# EAGLE schematic RH007.1 (EAGLE 7.1.0)
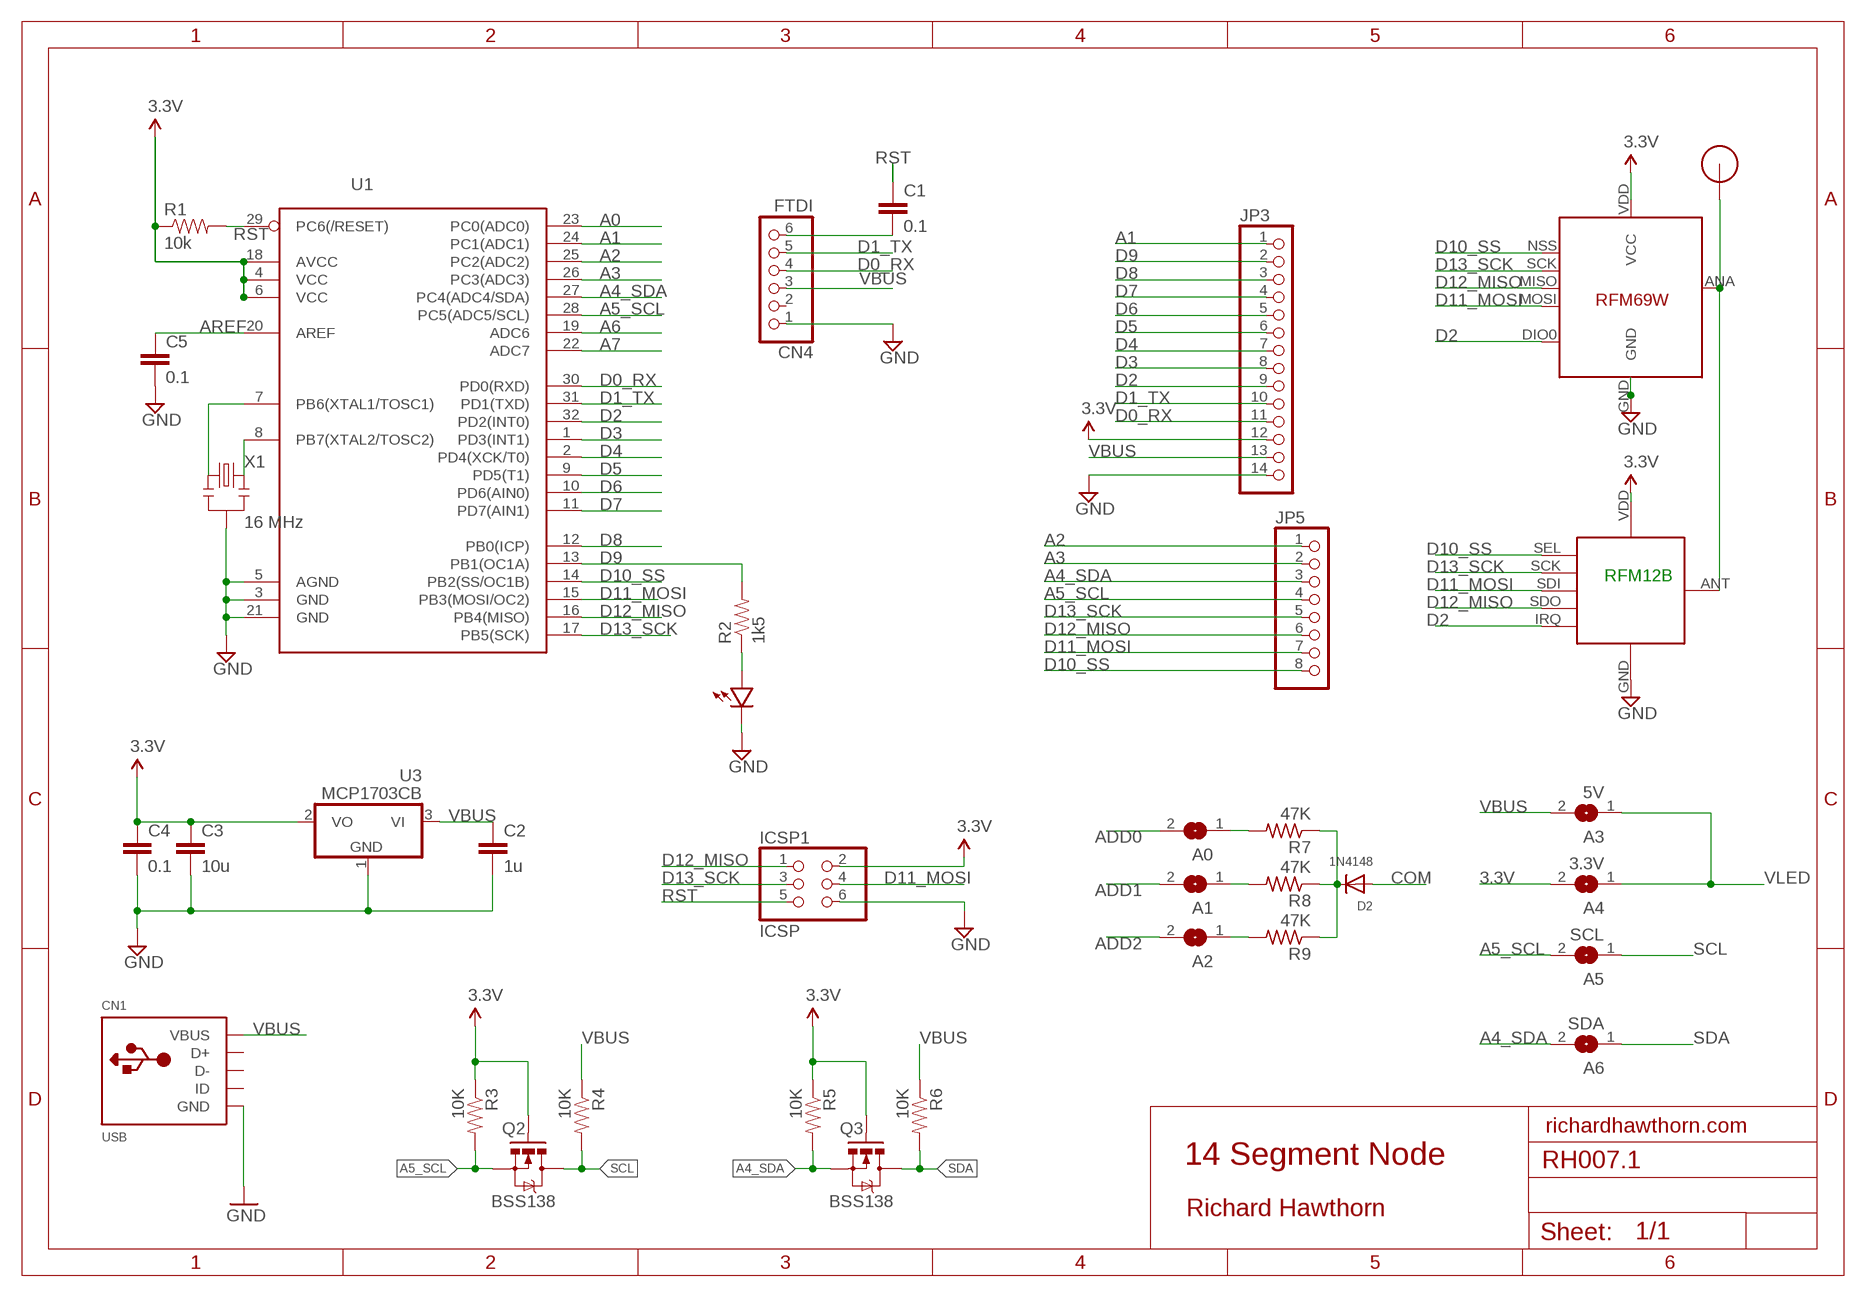
[diagram p0: schematic, sheet 1, part 1 of 2]
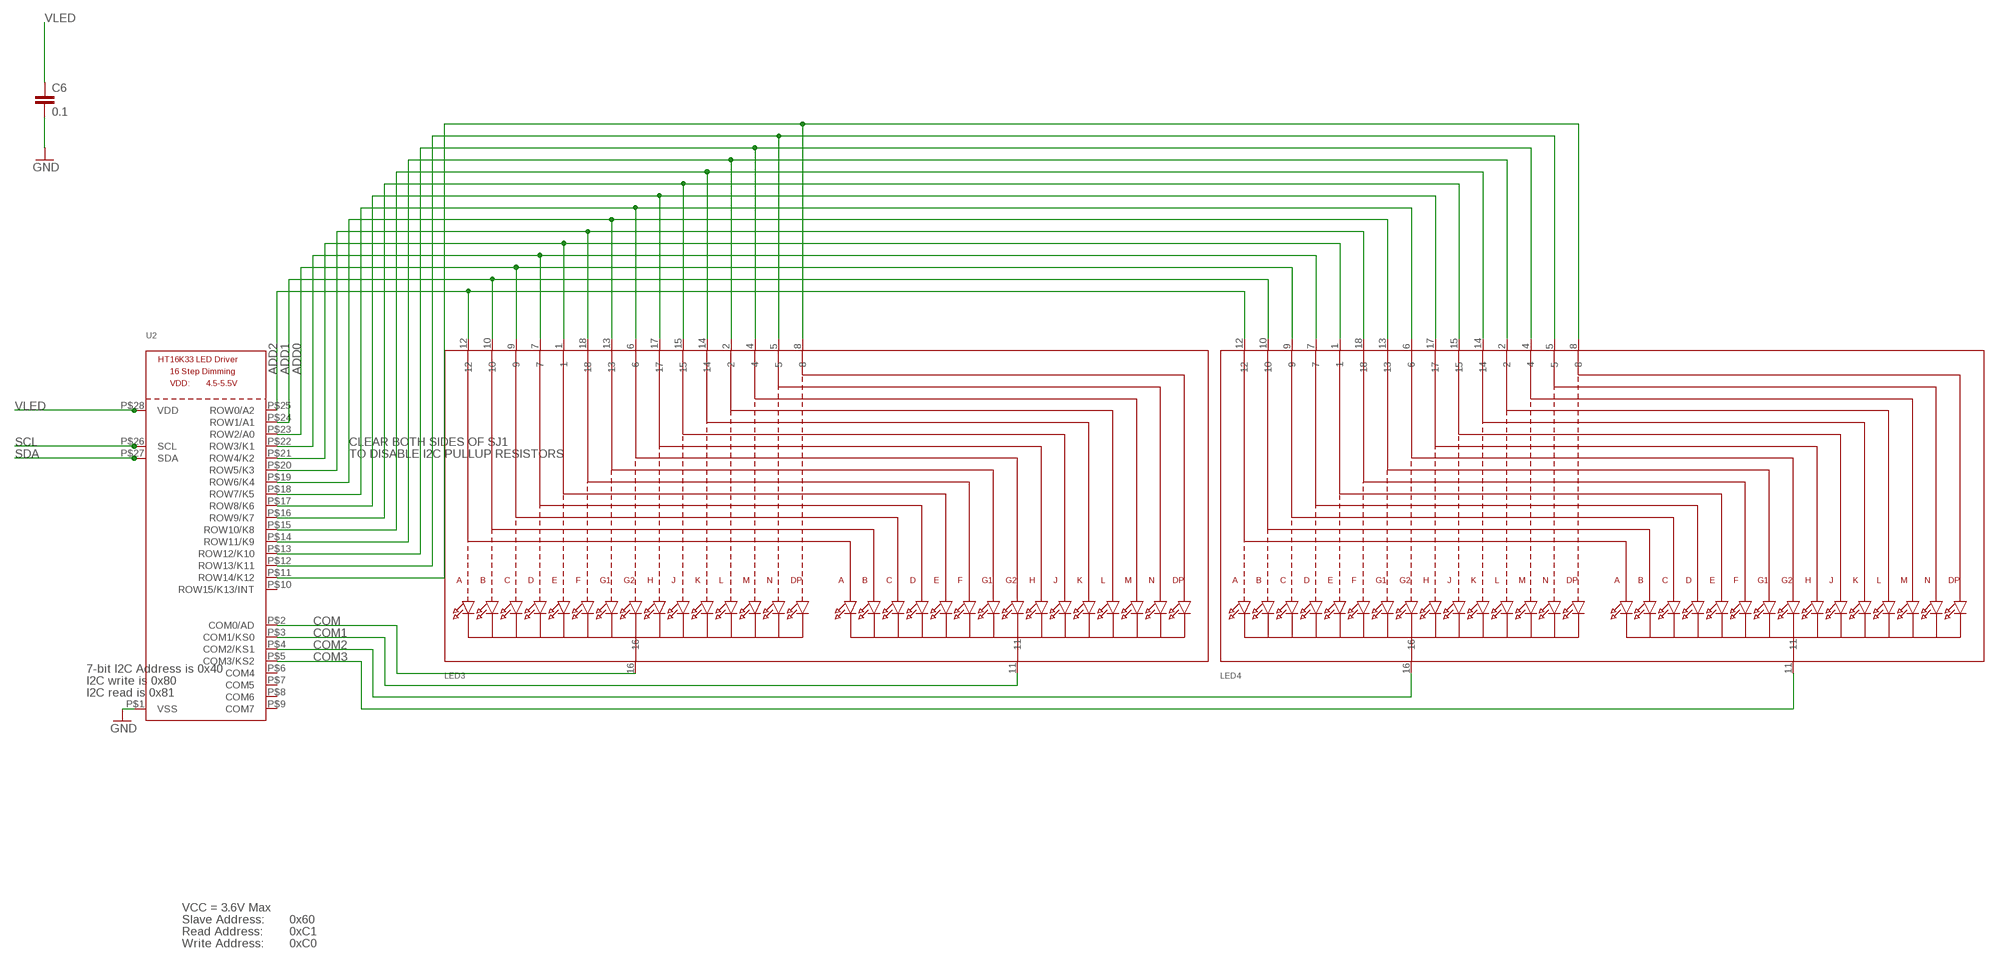
[diagram p1: schematic, sheet 1, part 2 of 2]

## Parts
A0  SOLDERJUMPERREFLOW_NOPASTE  [SOLDERJUMPER_REFLOW_NOPASTE]
A1  SOLDERJUMPERREFLOW_NOPASTE  [SOLDERJUMPER_REFLOW_NOPASTE]
A2  SOLDERJUMPERREFLOW_NOPASTE  [SOLDERJUMPER_REFLOW_NOPASTE]
A3  5V  SOLDERJUMPERREFLOW_NOPASTE  [SOLDERJUMPER_REFLOW_NOPASTE]
A4  3.3V  SOLDERJUMPERREFLOW_NOPASTE  [SOLDERJUMPER_REFLOW_NOPASTE]
A5  SCL  SOLDERJUMPERREFLOW_NOPASTE  [SOLDERJUMPER_REFLOW_NOPASTE]
A6  SDA  SOLDERJUMPERREFLOW_NOPASTE  [SOLDERJUMPER_REFLOW_NOPASTE]
C1  0.1  CAP0603-CAP  [0603-CAP]
C2  1u  CAP0603-CAP  [0603-CAP]
C3  10u  CAP0805-CAP  [0805-CAP]
C4  0.1  CAP0603-CAP  [0603-CAP]
C5  0.1  CAP0603-CAP  [0603-CAP]
C6  0.1  CAP0603-CAP  [0603-CAP]
CN1  USB  USBMINIB  [USB-MINIB]
CN4  FTDI  PINHD-1X6  [1X06]
D2  1N4148  DIODESOD-323F  [SOD-323F]
ICSP1  ICSP  PINHD-2X3  [2X03]
JP3  PINHD-1X14  [1X14]
JP5  PINHD-1X8  [1X08]
LED1  LED0603  [0603-LED]
LED3  DISP_SEGMENT_STARBURST_DUAL_COMMONCATHODE  [SEGMENT_STARTBUST_DUAL_KWA-541CBB]
LED4  DISP_SEGMENT_STARBURST_DUAL_COMMONCATHODE  [SEGMENT_STARTBUST_DUAL_KWA-541CBB]
Q2  BSS138  MOSFET-NCHANNELSMD  [SOT23-3]
Q3  BSS138  MOSFET-NCHANNELSMD  [SOT23-3]
R1  10k  RESISTOR0603-RES  [0603-RES]
R2  1k5  RESISTOR0805  [0805]
R3  10K  RESISTOR0603-RES  [0603-RES]
R4  10K  RESISTOR0603-RES  [0603-RES]
R5  10K  RESISTOR0603-RES  [0603-RES]
R6  10K  RESISTOR0603-RES  [0603-RES]
R7  47K  R-US_R0805  [R0805]
R8  47K  R-US_R0805  [R0805]
R9  47K  R-US_R0805  [R0805]
RF1  RFM12B  RFM12B_MINPADS  [RFM12B-MINPADS]
RF2  RFM69  [RFM69W-MINPADS]
U1  ATMega-328  ATMEGA168/328TQFP32  [TQFP32-08]
U2  HT16K33_SOP28  [SOP28_300MIL]
U3  MCP1703CB  [SOT23]
U$1  RFM12B_ANTENNA  [RFM12B-ANTENNA]
X1  16 MHz  RESONATORSMD  [RESONATOR-SMD]

## Nets
3.3V: A4.2 C3.1 C4.1 ICSP1.2 JP3.12 Q2.1(G) Q3.1(G) R1.1 R3.1 R5.1 RF1.VDD RF2.VDD(VCC) U1.4(VCC) U1.6(VCC) U1.18(AVCC) U3.2(VO)
A0: U1.23(PC0(ADC0))
A1: JP3.1 U1.24(PC1(ADC1))
A2: JP5.1 U1.25(PC2(ADC2))
A3: JP5.2 U1.26(PC3(ADC3))
A4_SDA: A6.2 JP5.3 Q3.2(S) R5.2 U1.27(PC4(ADC4/SDA))
A5_SCL: A5.2 JP5.4 Q2.2(S) R3.2 U1.28(PC5(ADC5/SCL))
A6: U1.19(ADC6)
A7: U1.22(ADC7)
ADD0: A0.2 LED3.9 LED4.9 U2.P$23(ROW2/A0)
ADD1: A1.2 LED3.10 LED4.10 U2.P$24(ROW1/A1)
ADD2: A2.2 LED3.12 LED4.12 U2.P$25(ROW0/A2)
AREF: C5.1 U1.20(AREF)
COM: D2.A LED3.16 U2.P$2(COM0/AD)
COM1: LED3.11 U2.P$3(COM1/KS0)
COM2: LED4.16 U2.P$4(COM2/KS1)
COM3: LED4.11 U2.P$5(COM3/KS2)
D0_RX: CN4.4 JP3.11 U1.30(PD0(RXD))
D1_TX: CN4.5 JP3.10 U1.31(PD1(TXD))
D2: JP3.9 RF1.IRQ RF2.DIO0 U1.32(PD2(INT0))
D3: JP3.8 U1.1(PD3(INT1))
D4: JP3.7 U1.2(PD4(XCK/T0))
D5: JP3.6 U1.9(PD5(T1))
D6: JP3.5 U1.10(PD6(AIN0))
D7: JP3.4 U1.11(PD7(AIN1))
D8: JP3.3 U1.12(PB0(ICP))
D9: JP3.2 R2.2 U1.13(PB1(OC1A))
D10_SS: JP5.8 RF1.SEL RF2.NSS(SEL) U1.14(PB2(SS/OC1B))
D11_MOSI: ICSP1.4 JP5.7 RF1.SDI(SDI/MOSI) RF2.MOSI U1.15(PB3(MOSI/OC2))
D12_MISO: ICSP1.1 JP5.6 RF1.SDO(SDO/MISO) RF2.MISO U1.16(PB4(MISO))
D13_SCK: ICSP1.3 JP5.5 RF1.SCK RF2.SCK U1.17(PB5(SCK))
GND [power]: C2.2 C3.2 C4.2 C5.2 C6.2 CN1.GND CN4.1 ICSP1.6 JP3.14 LED1.MINUS RF1.GND RF2.GND U1.3(GND) U1.5(AGND) U1.21(GND) U2.P$1(VSS) U3.1(GND) X1.2
N$1: U1.7(PB6(XTAL1/TOSC1)) X1.1
N$2: LED1.PLUS R2.1
N$3: RF1.ANT RF2.ANA(ANT) U$1.P$1
N$5: A0.1 R7.2
N$17: D2.C R7.1 R8.1 R9.1
N$18: A2.1 R9.2
N$19: A1.1 R8.2
N$20: C1.2 CN4.6
N$21: U1.8(PB7(XTAL2/TOSC2)) X1.3
N$22: LED3.7 LED4.7 U2.P$22(ROW3/K1)
N$23: LED3.1 LED4.1 U2.P$21(ROW4/K2)
N$24: LED3.18 LED4.18 U2.P$20(ROW5/K3)
N$25: LED3.13 LED4.13 U2.P$19(ROW6/K4)
N$26: LED3.6 LED4.6 U2.P$18(ROW7/K5)
N$29: LED3.17 LED4.17 U2.P$17(ROW8/K6)
N$30: LED3.15 LED4.15 U2.P$16(ROW9/K7)
N$31: LED3.14 LED4.14 U2.P$15(ROW10/K8)
N$32: LED3.2 LED4.2 U2.P$14(ROW11/K9)
N$33: LED3.4 LED4.4 U2.P$13(ROW12/K10)
N$34: LED3.5 LED4.5 U2.P$12(ROW13/K11)
N$35: LED3.8 LED4.8 U2.P$11(ROW14/K12)
RST: C1.1 ICSP1.5 R1.2 U1.29(PC6(/RESET))
SCL: A5.1 Q2.3(D) R4.2 U2.P$26(SCL)
SDA: A6.1 Q3.3(D) R6.2 U2.P$27(SDA)
VBUS [power]: A3.2 C2.1 CN1.VBUS CN4.3 JP3.13 R4.1 R6.1 U3.3(VI)
VLED [power]: A3.1 A4.1 C6.1 U2.P$28(VDD)
Unconnected: CN1.D+ CN1.D- CN1.ID CN4.2 U2.P$6(COM4) U2.P$7(COM5) U2.P$8(COM6) U2.P$9(COM7) U2.P$10(ROW15/K13/INT)

## Notes on the sheet
- RFM12B
- CLEAR BOTH SIDES OF SJ1
- TO DISABLE I2C PULLUP RESISTORS
- 7-bit I2C Address is 0x40
- I2C write is 0x80
- I2C read is 0x81
- richardhawthorn.com
- 14 Segment Node
- Richard Hawthorn
- VCC = 3.6V Max
- Slave Address: | 0x60
- Read Address: | 0xC1
- Write Address: | 0xC0

## Library data of the parts
A0 A1-A6 = microbuilder:SOLDERJUMPER: SMD Solder JUMPER Solder the two pads together to create a connection, or remove the solder to break it. REFLOW - Use this footprint for solder paste and reflow ovens. WAVE - Use this footprint for hand-soldering (larger pads). CLOSED - Has a trace between the two pads to ensure it is closed by default. The trace needs to be cut to disable the jumper, and can be closed again by creating a solder bridge between the two pads.
C1-C6 = LowPowerLab:CAP: Capacitor Standard 0603 ceramic capacitor, and 0.1" leaded capacitor.
CN1 = LowPowerLab:USB: USB Connectors USBMINIB - Surface Mount Female Mini-B USB Connector 4UConnector: 06564 By microbuilder.eu Thru-hole RA Female Mini-B USB Connector 4UConnector: 18732 By ladyada.net
CN4 = pinhead:PINHD-1X6: PIN HEADER
D2 = adafruit:DIODE: Diode SMADIODE - SMA Surface Mount Package 20V 1A Schottky Diode Digikey: 641-1014-6-ND DO-1N4148 - Through Hole Small Current Diode SOD-123 20V 1 A (.5mV Vf) Schottky Diode - Digikey: MBRX120TPMSCT-ND SOD-323 10V 570mA (.38mV Vf, 3ns) Schottky Diode - Digikey: ZLLS410CT-ND SOD-523 30V 30mA Schottky Diode (RB751S-40TE61) - Digikey: RB751S-40TE61CT-ND SOT23-R/W - SOT23 Package (R = Solder Paste/Reflow Ovens, W = Hand-Soldering) BAT54Film 40V 300mA - Digikey: 497-7162-1-ND
ICSP1 = pinhead:PINHD-2X3: PIN HEADER
JP3 = pinhead:PINHD-1X14: PIN HEADER
JP5 = pinhead:PINHD-1X8: PIN HEADER
LED1 = LowPowerLab:LED
LED3 LED4 = microbuilder:DISP_SEGMENT_STARBURST_DUAL_COMMONCATHODE: 2 x Starburst Segment Displays - Common Cathode Luckylight KWA-541CBB
Q2 Q3 = SparkFun:MOSFET-NCHANNEL
R1 R2 = LowPowerLab:RESISTOR: Resistor Basic schematic elements and footprints for 0603, 1206, and PTH resistors.
R3-R6 = SparkFun:RESISTOR: Resistor Basic schematic elements and footprints for 0603, 1206, and PTH resistors.
R7-R9 = adafruit:R-US_: RESISTOR, American symbol
RF1 = LowPowerLab:RFM12B_MINPADS
RF2 = LowPowerLab:RFM69
U1 = LowPowerLab:ATMEGA168/328: Atmel 32-pin 8-bit micro, 16k flash.
U2 = microbuilder:HT16K33_SOP28
U3 = linear:MCP1703: 250 mA, 16V, Low Quiescent Current LDO Regulator Source: http://ww1.microchip.com/downloads/en/DeviceDoc/22049b.pdf
U$1 = LowPowerLab:RFM12B_ANTENNA
X1 = SparkFun:RESONATOR: Resonator Small SMD resonator. This is the itty bitty 10/20MHz resonators with built in caps. CSTCE10M0G55 and CSTCE20M0V53. Footprint has been reviewed closely but hasn't been tested yet.

## Net classes
1 power: width 0.381 mm, clearance 0.254 mm